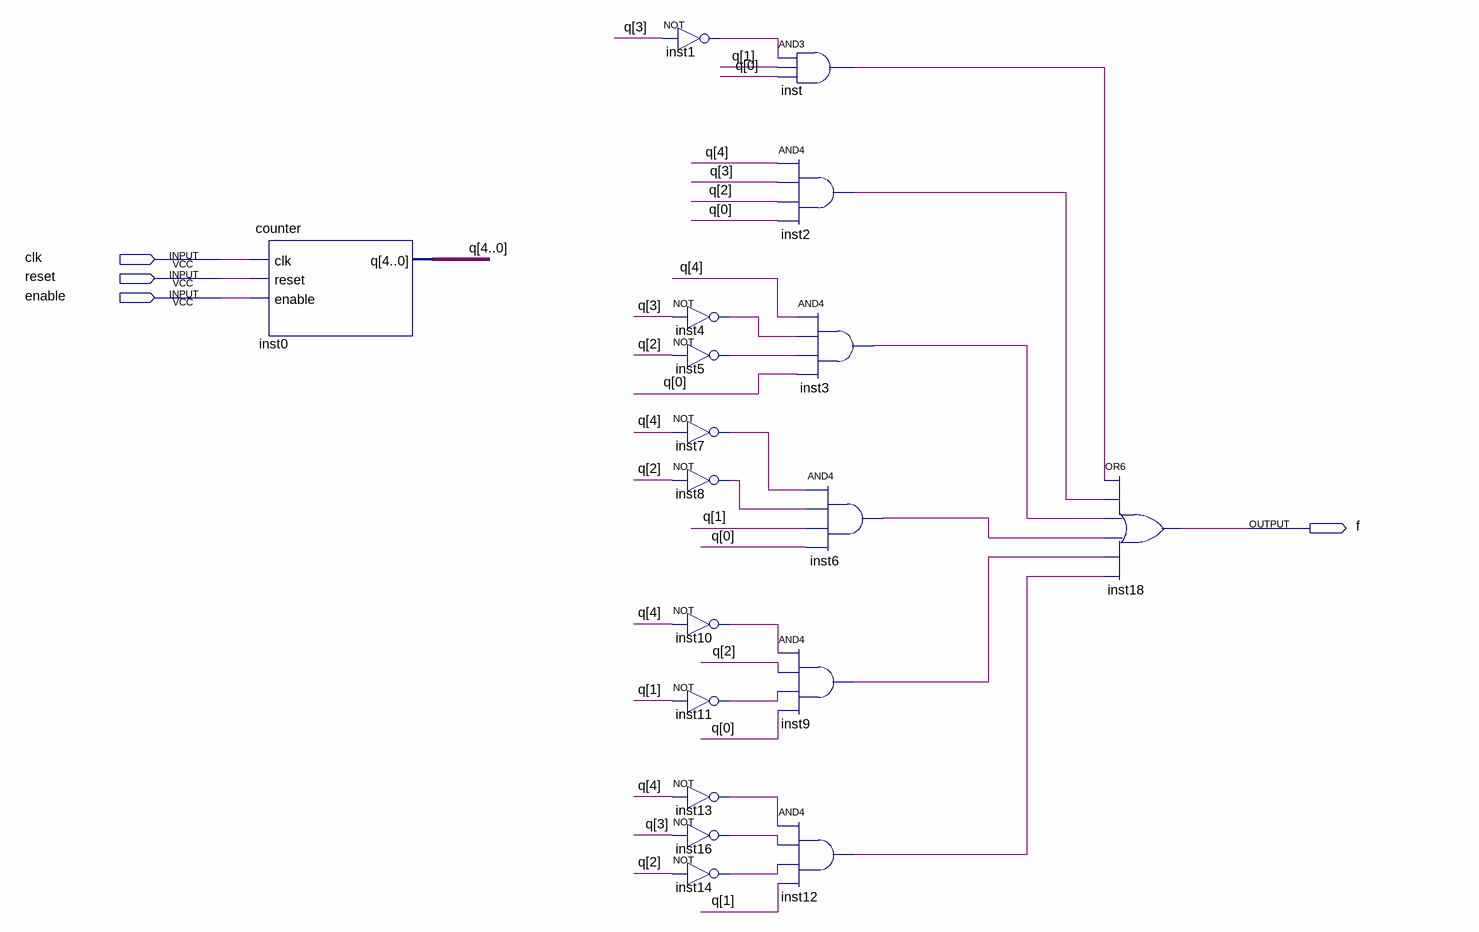
[diagram p0: schematic sheet]
// Quartus schematic extension.bdf as structural Verilog: 18 symbols, 4 pins
module extension (
  input  clk,
  input  reset,
  input  enable,
  output f
);

  wire inst1_out, inst2_out, inst3_out, inst4_out, inst5_out, inst6_out, inst7_out, inst8_out, inst9_out,
       inst10_out, inst11_out, inst12_out, inst13_out, inst14_out, inst16_out, inst_out;
  wire [4:0] q;

  counter inst0 (.clk(clk), .reset(reset), .enable(enable), .q(q));
  not inst1 (inst1_out, q[3]);
  not inst4 (inst4_out, q[3]);
  not inst5 (inst5_out, q[2]);
  not inst7 (inst7_out, q[4]);
  not inst8 (inst8_out, q[2]);
  not inst10 (inst10_out, q[4]);
  not inst11 (inst11_out, q[1]);
  not inst13 (inst13_out, q[4]);
  not inst16 (inst16_out, q[3]);
  not inst14 (inst14_out, q[2]);
  and inst (inst_out, inst1_out, q[1], q[0]);
  and inst2 (inst2_out, q[4], q[3], q[2], q[0]);
  and inst9 (inst9_out, inst10_out, q[2], inst11_out, q[0]);
  and inst12 (inst12_out, inst13_out, inst16_out, inst14_out, q[1]);
  and inst3 (inst3_out, q[4], inst4_out, inst5_out, q[0]);
  and inst6 (inst6_out, inst7_out, inst8_out, q[1], q[0]);
  or inst18 (f, inst_out, inst2_out, inst3_out, inst6_out, inst9_out, inst12_out);
endmodule
